# EAGLE design PCB (EAGLE 8.1.0)
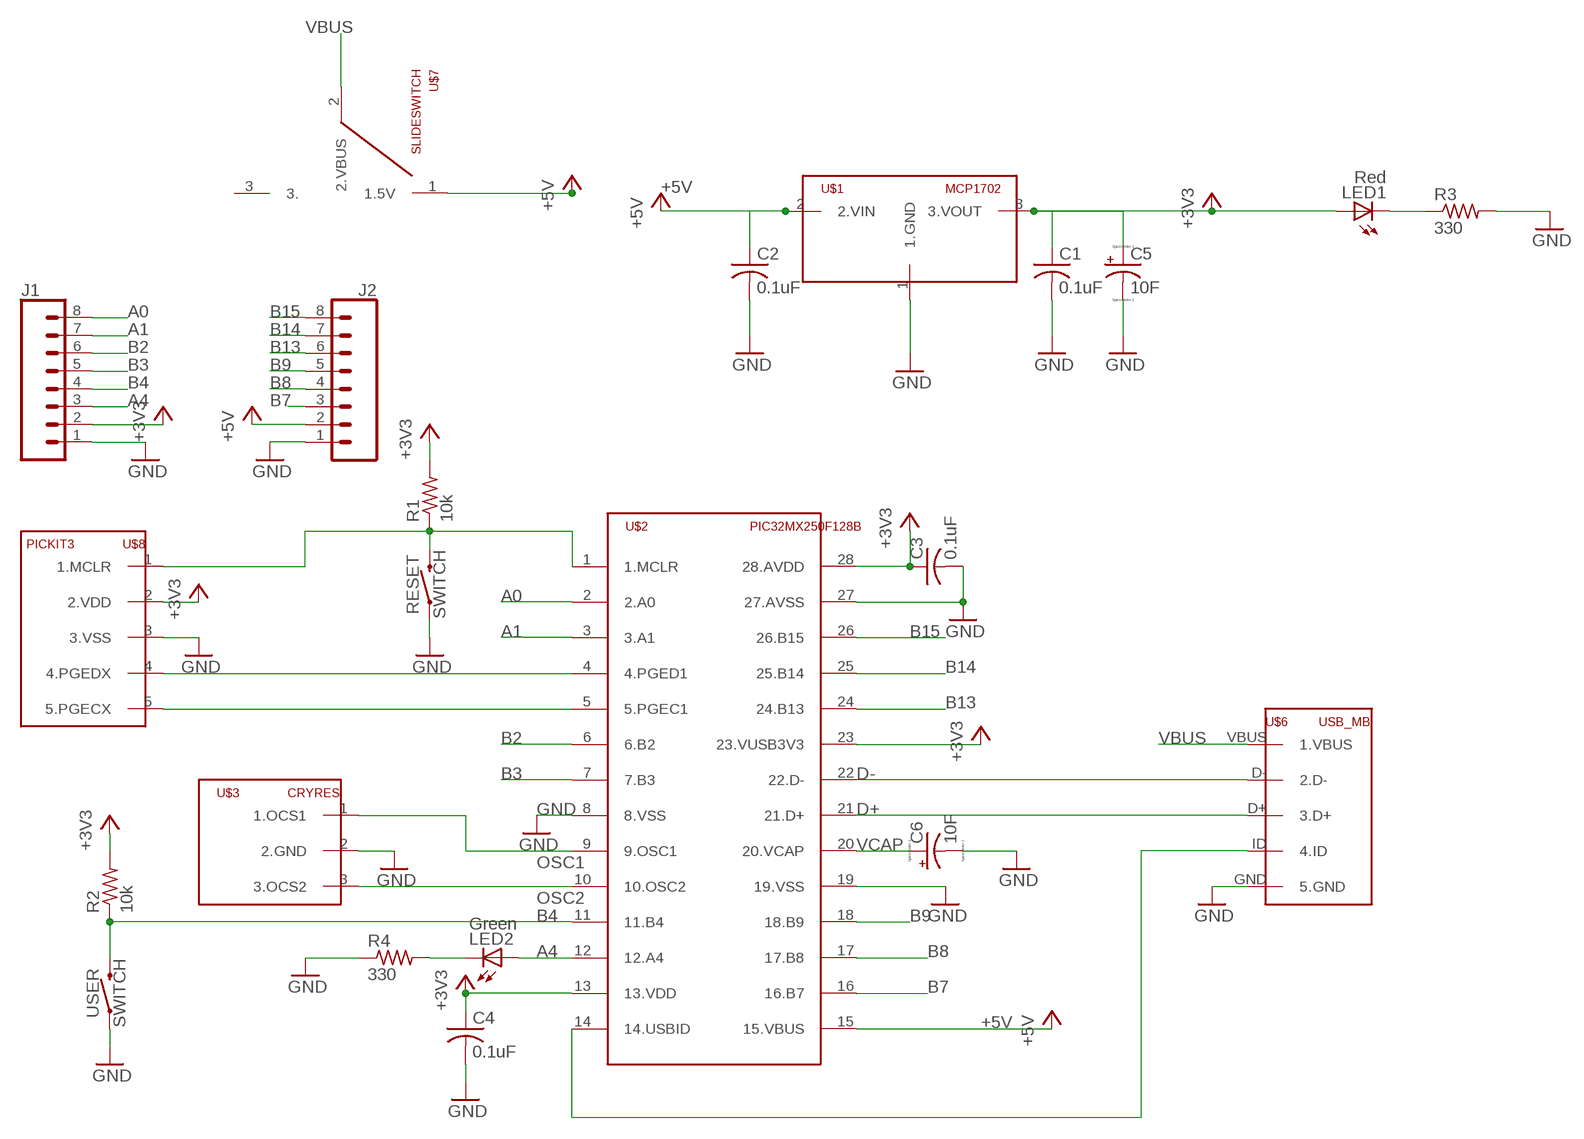
[diagram p0: schematic, sheet 1]

## Parts
C1  0.1uF  C-US025-025X050  [C025-025X050]
C2  0.1uF  C-US025-025X050  [C025-025X050]
C3  0.1uF  C-US025-025X050  [C025-025X050]
C4  0.1uF  C-US025-025X050  [C025-025X050]
C5  10F  CPOL-USE5-5  [E5-5]
C6  10F  CPOL-USE5-5  [E5-5]
J1  CONN_08"  [1X08]
J2  CONN_08"  [1X08]
LED1  Red  LED3MM  [LED3MM]
LED2  Green  LED3MM  [LED3MM]
R1  10k  R-US_0207/10  [0207/10]
R2  10k  R-US_0207/10  [0207/10]
R3  330  R-US_0207/10  [0207/10]
R4  330  R-US_0207/10  [0207/10]
RESET  SWITCH  [SWITCH]
U$1  MCP1702  [TO92]
U$2  PIC32MX250F128B  [DIL28-3]
U$3  CRYRES  [CRYSTAL]
U$6  USB_MB  [USB-MB-H]
U$7  SLIDESWITCH  [SLIDESWITCH]
U$8  PICKIT3  [1X05]
USER  SWITCH  [SWITCH]

## Nets
+3V3: C1.1 C3.1 C4.1 C5.+ J1.2 LED1.A R1.2 R2.2 U$1.3(3.VOUT) U$2.13(13.VDD) U$2.23(23.VUSB3V3) U$2.28(28.AVDD) U$8.2(2.VDD)
+5V: C2.1 J2.2 U$1.2(2.VIN) U$2.15(15.VBUS) U$7.1(1.5V)
A0: J1.8 U$2.2(2.A0)
A1: J1.7 U$2.3(3.A1)
A4: J1.3 LED2.A U$2.12(12.A4)
B2: J1.6 U$2.6(6.B2)
B3: J1.5 U$2.7(7.B3)
B4: J1.4 R2.1 U$2.11(11.B4) USER.2
B7: J2.3 U$2.16(16.B7)
B8: J2.4 U$2.17(17.B8)
B9: J2.5 U$2.18(18.B9)
B13: J2.6 U$2.24(24.B13)
B14: J2.7 U$2.25(25.B14)
B15: J2.8 U$2.26(26.B15)
D+: U$2.21(21.D+) U$6.D+(3.D+)
D-: U$2.22(22.D-) U$6.D-(2.D-)
GND: C1.2 C2.2 C3.2 C4.2 C5.- C6.- J1.1 J2.1 R3.2 R4.1 RESET.1 U$1.1(1.GND) U$2.8(8.VSS) U$2.19(19.VSS) U$2.27(27.AVSS) U$3.2(2.GND) U$6.GND(5.GND) U$8.3(3.VSS) USER.1
MCLR: R1.1 RESET.2 U$2.1(1.MCLR) U$8.1(1.MCLR)
N$1: LED1.K(C) R3.1
N$2: LED2.K(C) R4.2
OSC1: U$2.9(9.OSC1) U$3.1(1.OCS1)
OSC2: U$2.10(10.OSC2) U$3.3(3.OCS2)
PEGC1: U$2.5(5.PGEC1) U$8.5(5.PGECX)
PEGD1: U$2.4(4.PGED1) U$8.4(4.PGEDX)
USBID: U$2.14(14.USBID) U$6.ID(4.ID)
VBUS: U$6.VBUS(1.VBUS) U$7.2(2.VBUS)
VCAP: C6.+ U$2.20(20.VCAP)
Unconnected: U$7.3(3.)

## Library data of the parts
C1-C4 = ME433:C-US: CAPACITOR, American symbol
C5 C6 = ME433:CPOL-US: POLARIZED CAPACITOR, American symbol
J1 J2 = ME433:CONN_08: Multi connection point. Often used as Generic Header-pin footprint for 0.1 inch spaced/style header connections On any of the 0.1 inch spaced packages, you can populate with these: Break Away Headers - Straight <https://www.sparkfun.com/products/116> (PRT-00116) Break Away Male Headers - Right Angle <https://www.sparkfun.com/products/553> (PRT-00553) Female Headers <https://www.sparkfun.com/products/115> (PRT-00115) Break Away Headers - Machine Pin <https://www.sparkfun.com/products/117> (PRT-00117) Break Away Female Headers - Swiss Machine Pin <https://www.sparkfun.com/products/743> (PRT-00743) Arduino Stackable Header - 8 Pin <https://www.sparkfun.com/products/9279> (PRT-09279) For SCREWTERMINALS and SPRING TERMINALS visit here: Screw Terimnals on SparkFun.com <https://www.sparkfun.com/search/results?term=Screw+Terminals> (5mm/3.5mm/2.54mm spacing) This device is also useful as a general connection point to wire up your design to another part of your project. Our various solder wires solder well into these plated through hole pads. Hook-Up Wire - Assortment (Stranded, 22 AWG) <https://www.sparkfun.com/products/11375> (PRT-11375) Hook-Up Wire - Assortment (Solid Core, 22 AWG) <https://www.sparkfun.com/products/11367> (PRT-11367) View the entire wire category on our website here <https://www.sparkfun.com/categories/141> Special notes: Molex polarized connector foot print use with SKU : PRT-08231 with associated crimp pins and housings. 1MM SMD Version SKU: PRT-10208 NOTES ON THE VARIANTS LOCK and LOCK_LONGPADS... This footprint was designed to help hold the alignment of a through-hole component (i.e. 6-pin header) while soldering it into place. You may notice that each hole has been shifted either up or down by 0.005 of an inch from it's more standard position (which is a perfectly straight line). This slight alteration caused the pins (the squares in the middle) to touch the edges of the holes. Because they are alternating, it causes a "brace" to hold the component in place. 0.005 has proven to be the perfect amount of "off-center" position when using our standard breakaway headers. Although looks a little odd when you look at the bare footprint, once you have a header in there, the alteration is very hard to notice. Also,if you push a header all the way into place, it is covered up entirely on the bottom side.; PROD_ID: CONN-08438
LED1 LED2 = led:LED: LED OSRAM: - CHIPLED LG R971, LG N971, LY N971, LG Q971, LY Q971, LO R971, LY R971 LH N974, LH R974 LS Q976, LO Q976, LY Q976 LO Q996 - Hyper CHIPLED LW Q18S LB Q993, LB Q99A, LB R99A - SideLED LS A670, LO A670, LY A670, LG A670, LP A670 LB A673, LV A673, LT A673, LW A673 LH A674 LY A675 LS A676, LA A676, LO A676, LY A676, LW A676 LS A679, LY A679, LG A679 - Hyper Micro SIDELED® LS Y876, LA Y876, LO Y876, LY Y876 LT Y87S - SmartLED LW L88C, LW L88S LB L89C, LB L89S, LG L890 LS L89K, LO L89K, LY L89K LS L896, LA L896, LO L896, LY L896 - TOPLED LS T670, LO T670, LY T670, LG T670, LP T670 LSG T670, LSP T670, LSY T670, LOP T670, LYG T670 LG T671, LOG T671, LSG T671 LB T673, LV T673, LT T673, LW T673 LH T674 LS T676, LA T676, LO T676, LY T676, LB T676, LH T676, LSB T676, LW T676 LB T67C, LV T67C, LT T67C, LS T67K, LO T67K, LY T67K, LW E67C LS E67B, LA E67B, LO E67B, LY E67B, LB E67C, LV E67C, LT E67C LW T67C LS T679, LY T679, LG T679 LS T770, LO T770, LY T770, LG T770, LP T770 LB T773, LV T773, LT T773, LW T773 LH T774 LS E675, LA E675, LY E675, LS T675 LS T776, LA T776, LO T776, LY T776, LB T776 LHGB T686 LT T68C, LB T68C - Hyper Mini TOPLED® LB M676 - Mini TOPLED Santana® LG M470 LS M47K, LO M47K, LY M47K Source: http://www.osram.convergy.de LUXEON: - LUMILED® LXK2-PW12-R00, LXK2-PW12-S00, LXK2-PW14-U00, LXK2-PW14-V00 LXK2-PM12-R00, LXK2-PM12-S00, LXK2-PM14-U00 LXK2-PE12-Q00, LXK2-PE12-R00, LXK2-PE12-S00, LXK2-PE14-T00, LXK2-PE14-U00 LXK2-PB12-K00, LXK2-PB12-L00, LXK2-PB12-M00, LXK2-PB14-N00, LXK2-PB14-P00, LXK2-PB14-Q00 LXK2-PR12-L00, LXK2-PR12-M00, LXK2-PR14-Q00, LXK2-PR14-R00 LXK2-PD12-Q00, LXK2-PD12-R00, LXK2-PD12-S00 LXK2-PH12-R00, LXK2-PH12-S00 LXK2-PL12-P00, LXK2-PL12-Q00, LXK2-PL12-R00 Source: www.luxeon.com KINGBRIGHT: KA-3528ASYC Source: www.kingbright.com
R1-R4 = resistor:R-US_: RESISTOR, American symbol
RESET USER = ME433:SWITCH
U$1 = ME433:MCP1702
U$2 = ME433:PIC32MX250F128B
U$3 = ME433:CRYRES
U$6 = ME433:USB_MB
U$7 = ME433:SLIDESWITCH
U$8 = ME433:PICKIT3

## Board
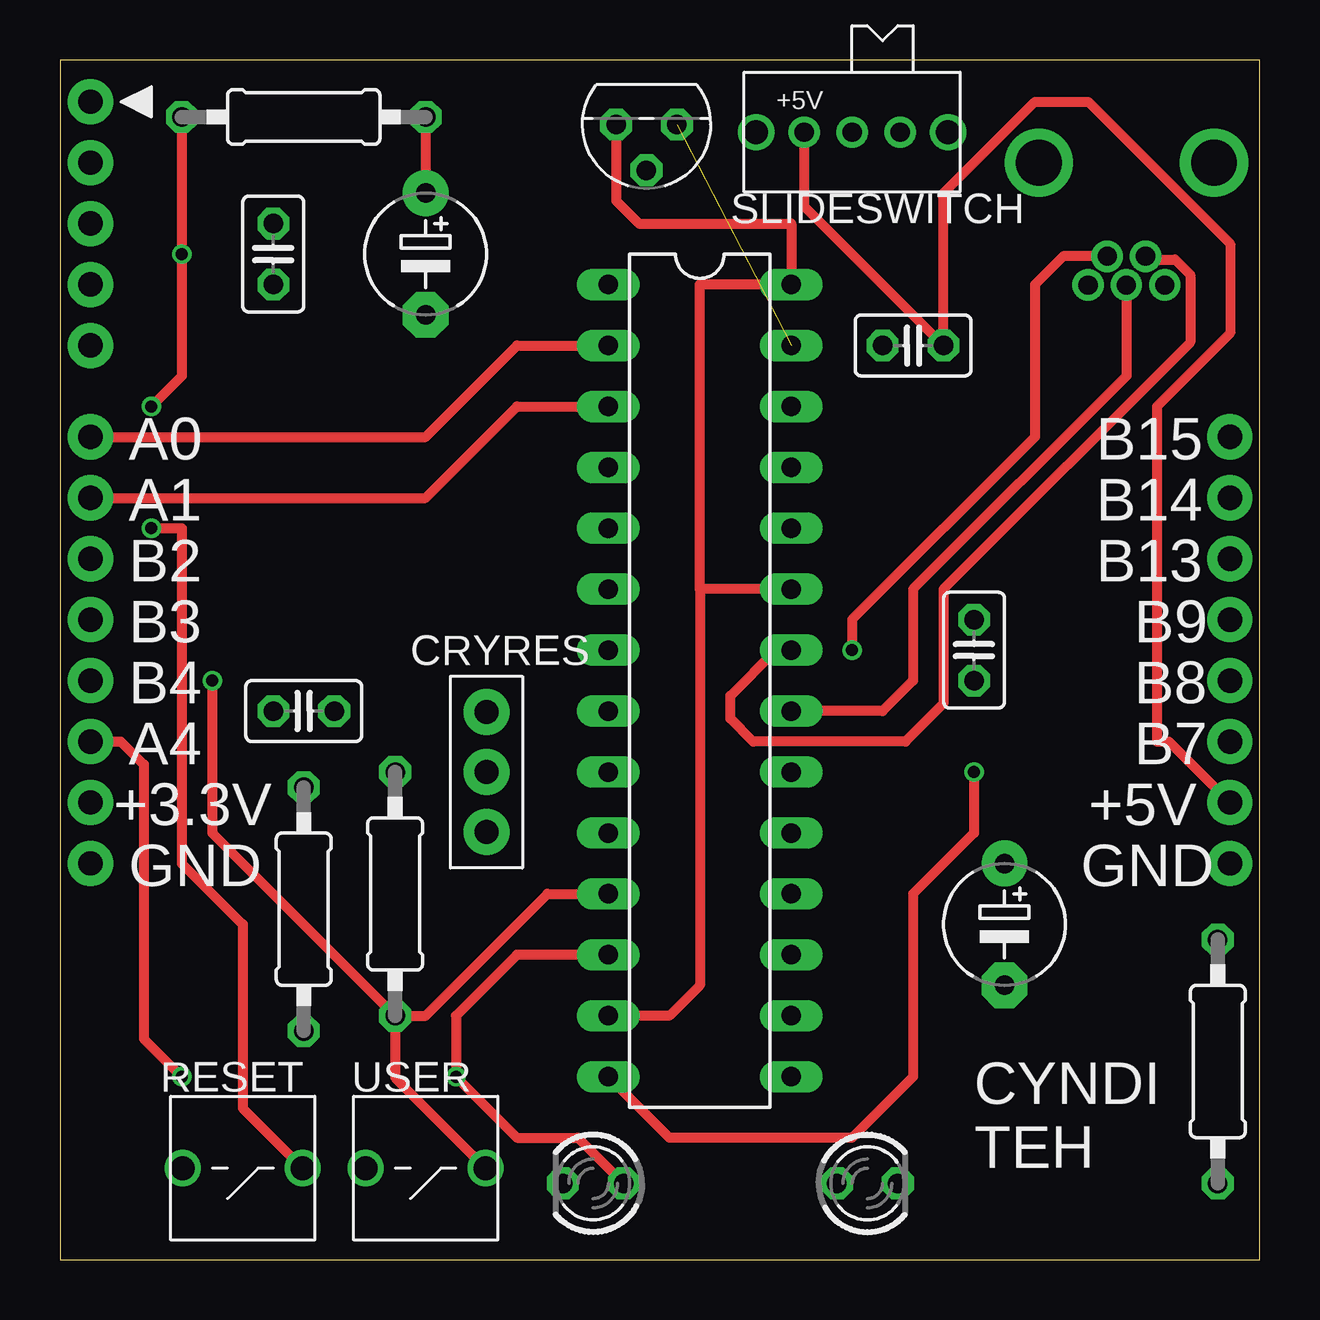
[diagram p1: board, top side]
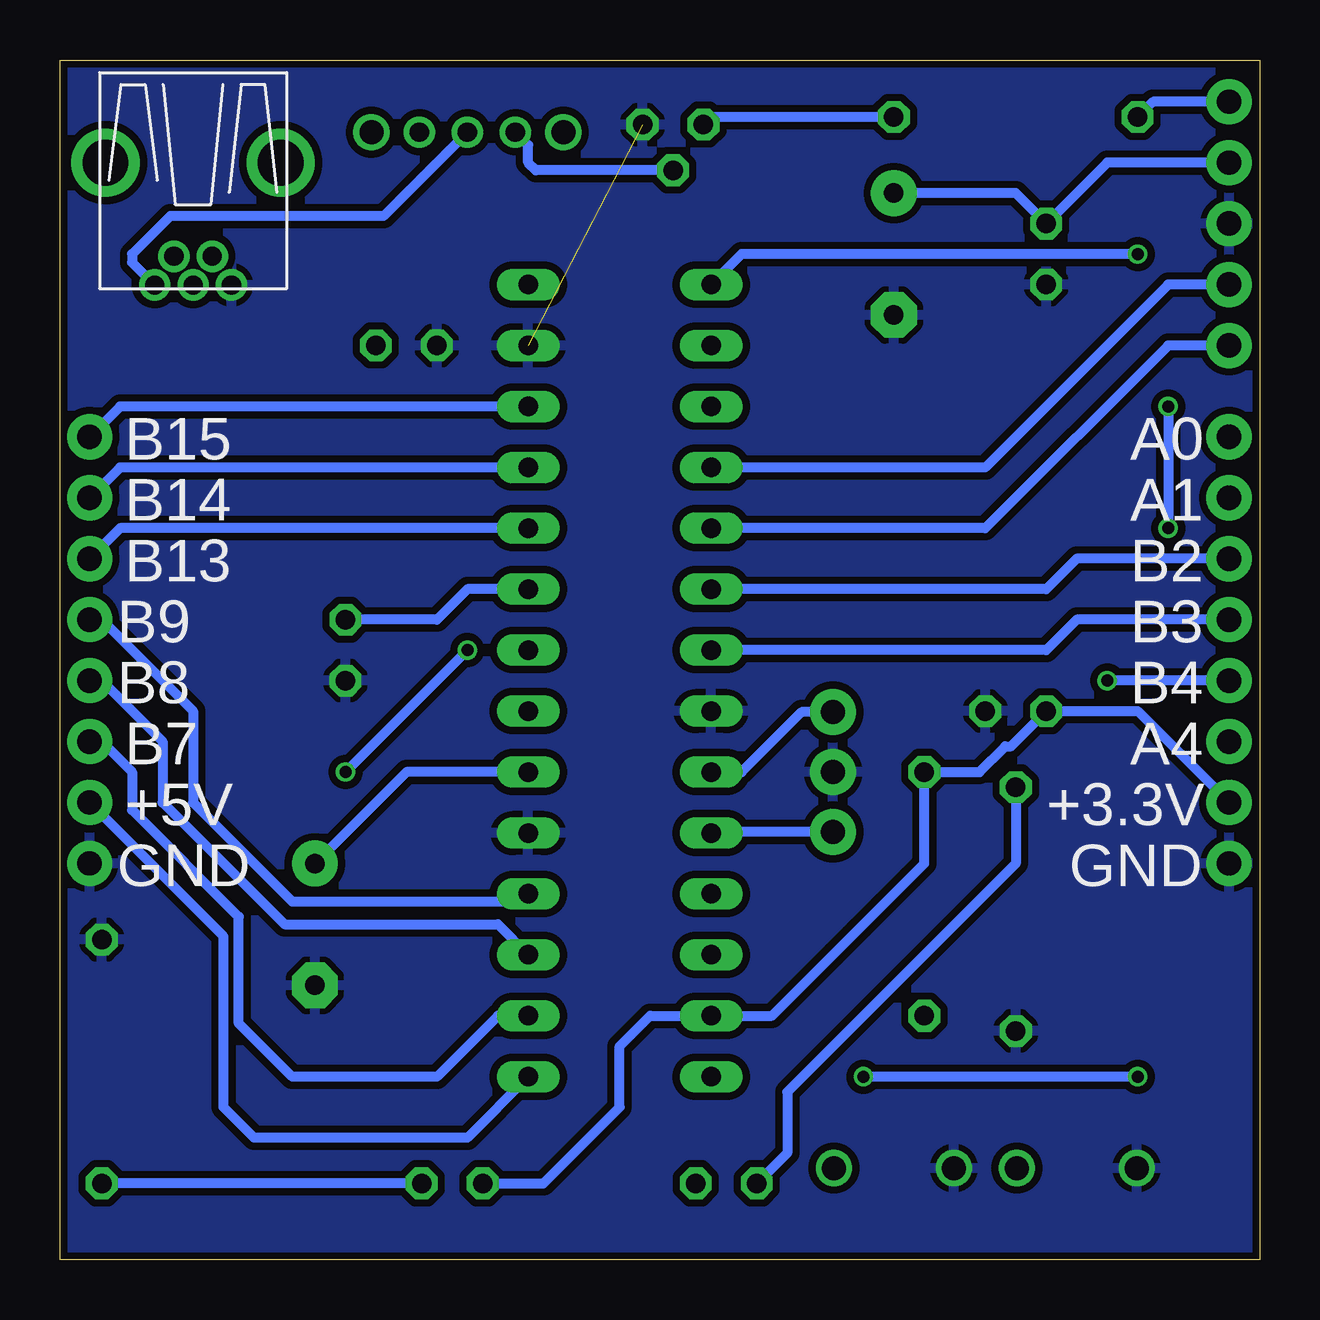
[diagram p2: board, bottom side, seen from below]

Size 50 x 50 mm. Coordinates in mm from the lower left corner, seen from the top.
Outline: 0,0 50,0 50,50 0,50 0,0
Copper layers (1*16): Top 0.035mm / dielectric 1.5mm / Bottom 0.035mm
Design rules "SeeedStudio_2layer_DRU_no_angle_20140221": minimum track width 6mil, minimum drill 12mil, track to track 6mil, track to pad 6mil, pad to pad 6mil, via to via 6mil, smd to smd 0mil, copper to edge 10mil, drill to drill 10mil, minimum pad ring 10mil, minimum via ring 6mil, stop-mask expansion 2mil, vias tented up to drill 100mil, thermal gap 10mil

### Footprints (pad centres in the part's own frame; a part is rotated, then mirrored left to right if it is on the bottom)
C025-025X050 = drill 0.813 octagon: 1 -1.27,0; 2 1.27,0
E5-5 = drill 0.813 pad 1.905: + -2.54,0 | drill 0.813 pad 1.905 octagon: - 2.54,0
1X08 = drill 1.016 pad 1.88: 1 0,0; 2 2.54,0; 3 5.08,0; 4 7.62,0; 5 10.16,0; 6 12.7,0; 7 15.24,0; 8 17.78,0
LED3MM = drill 0.813 octagon: A -1.27,0; K 1.27,0
0207/10 = drill 0.813 octagon: 1 -5.08,0; 2 5.08,0
SWITCH = drill 1: 1 2.5,0; 2 -2.5,0
TO92 = drill 0.813 octagon: 1 -1.27,0; 2 0,1.905; 3 1.27,0
DIL28-3 = drill 0.813 long: 1 -16.51,-3.81; 2 -13.97,-3.81; 3 -11.43,-3.81; 4 -8.89,-3.81; 5 -6.35,-3.81; 6 -3.81,-3.81; 7 -1.27,-3.81; 8 1.27,-3.81; 9 3.81,-3.81; 10 6.35,-3.81; 11 8.89,-3.81; 12 11.43,-3.81; 13 13.97,-3.81; 14 16.51,-3.81; 15 16.51,3.81; 16 13.97,3.81; 17 11.43,3.81; 18 8.89,3.81; 19 6.35,3.81; 20 3.81,3.81; 21 1.27,3.81; 22 -1.27,3.81; 23 -3.81,3.81; 24 -6.35,3.81; 25 -8.89,3.81; 26 -11.43,3.81; 27 -13.97,3.81; 28 -16.51,3.81
CRYSTAL = drill 1 pad 1.93: 1 -2.5,0; 2 0,0; 3 2.5,0
USB-MB-H = drill 0.8: D+ 5.1,0; D- 3.9,0.8; GND 5.1,-1.6; ID 3.9,-0.8; VBUS 5.1,1.6 | drill 1.9: P$6 0,-3.65; P$7 0,3.65
SLIDESWITCH = drill 0.8: 1 -2,0; 2 0,0; 3 2,0 | drill 1: S1 -4,0; S2 4,0
1X05 = drill 1.016 pad 1.88: 1 0,0; 2 2.54,0; 3 5.08,0; 4 7.62,0; 5 10.16,0

### Placement (x,y rotation side)
C1  8.89,41.91 270 top
C2  35.56,38.1 180 top
C3  38.1,25.4 270 top
C4  10.16,22.86 0 top
C5  15.24,41.91 270 top
C6  39.37,13.97 270 top
J1  1.27,16.51 90 top
J2  48.77,16.51 90 top
LED1  33.66,3.17 0 top
LED2  22.23,3.17 180 top
R1  10.16,47.62 0 top
R2  13.97,15.24 90 top
R3  48.26,8.26 90 top
R4  10.16,14.61 90 top
RESET  7.62,3.81 180 top
U$1  24.45,47.31 180 top
U$2  26.67,24.13 270 top
U$3  17.78,20.32 270 top
U$6  44.45,45.72 270 top
U$7  33.02,46.99 0 top
U$8  1.27,48.26 270 top
USER  15.24,3.81 180 top

### Tracks (layer width: path | path; a pad name or v marks a point on that pad's centre or on a via)
+3V3
  Top 0.406: U$1.3 23.18,44.13 24.13,43.18 30.48,43.18 U$2.28 26.67,40.64 26.67,27.94 | U$2.13 25.4,10.16 26.67,11.43 26.67,27.94 | U$2.23 26.67,27.94 | R1.2 C5.+
  Bottom 0.406: R1.2 22.86,47.62 U$1.3 | U$2.23 33.02,27.94 34.29,26.67 C3.1 | J1.2 5.08,22.86 C4.1 10.36,21.39 10.6,21.39 11.67,20.32 R2.2 13.97,16.51 20.32,10.16 U$2.13 25.4,10.16 26.67,8.89 26.67,6.35 29.84,3.17 LED1.A | U$8.2 6.35,45.72 C1.1 10.16,44.45 C5.+
+5V
  Top 0.406: U$7.1 31.02,43.91 C2.1 36.83,44.45 40.64,48.26 42.86,48.26 48.78,42.34 48.78,38.62 45.72,35.56 45.72,21.59 46.23,21.59 J2.2
  Bottom 0.406: U$2.15 33.02,5.08 41.91,5.08 43.18,6.35 43.18,13.46 J2.2 | U$1.2 30.16,45.4 30.48,45.72 30.48,46.45 U$7.1
A0
  Top 0.406: J1.8 15.24,34.29 19.05,38.1 U$2.2
A1
  Top 0.406: J1.7 15.24,31.75 19.05,35.56 U$2.3
A4  (via drill 0.5)
  Top 0.406: U$2.12 19.05,12.7 16.51,10.16 v16.51,7.62 19.05,5.08 21.59,5.08 LED2.A | J1.3 2.54,21.59 3.49,20.64 3.49,9.21 v5.08,7.62
  Bottom 0.406: v5.08,7.62 v16.51,7.62
B2
  Bottom 0.406: J1.6 7.62,29.21 8.89,27.94 U$2.6
B3
  Bottom 0.406: J1.5 7.62,26.67 8.89,25.4 U$2.7
B4  (via drill 0.5)
  Top 0.406: v6.35,24.13 6.35,17.78 R2.1 | R2.1 15.24,10.16 20.32,15.24 U$2.11 | R2.1 13.97,7.58 USER.2
  Bottom 0.406: J1.4 v6.35,24.13
B7
  Bottom 0.406: U$2.16 31.75,10.16 34.29,7.62 40.32,7.62 42.55,9.84 42.55,14.29 46.99,18.73 46.99,20.32 48.26,21.59 J2.3
B8
  Bottom 0.406: J2.4 48.26,24.13 45.72,21.59 45.72,19.05 40.64,13.97 31.75,13.97 U$2.17
B9
  Bottom 0.406: J2.5 48.26,26.67 44.45,22.86 44.45,19.05 40.32,14.92 30.8,14.92 U$2.18
B13
  Bottom 0.406: U$2.24 47.5,30.48 J2.6
B14
  Bottom 0.406: J2.7 47.5,33.02 U$2.25
B15
  Bottom 0.406: J2.8 47.5,35.56 U$2.26
D+
  Top 0.406: U$6.D+ 44.45,36.83 35.56,27.94 35.56,24.13 34.29,22.86 U$2.21
D-
  Top 0.406: U$6.D- 45.39,41.68 46.49,41.68 47.11,41.06 47.11,38.22 36.83,27.94 36.83,23.18 35.24,21.59 28.89,21.59 27.94,22.54 27.94,23.5 29.84,25.4 U$2.22
GND  (1 unrouted)
  pour Bottom (isolate 0.305): 0,50.16 50.16,50.16 50.16,0 0,0
MCLR  (via drill 0.5)
  Top 0.406: R1.1 v5.08,41.91 5.08,36.83 v3.81,35.56 | v3.81,30.48 5.08,30.48 5.08,16.51 7.62,13.97 7.62,6.31 RESET.2
  Bottom 0.406: U$8.1 4.45,48.26 R1.1 | U$2.1 21.59,41.91 v5.08,41.91 | v3.81,35.56 v3.81,30.48
N$1
  Bottom 0.406: LED1.K R3.1
N$2
  Bottom 0.406: R4.2 10.16,16.51 19.68,6.99 19.68,4.45 LED2.K
OSC1
  Bottom 0.406: U$3.1 19.09,22.82 21.59,20.32 U$2.9
OSC2
  Bottom 0.406: U$3.3 22.82,17.82 U$2.10
PEGC1
  Bottom 0.406: U$8.5 3.81,38.1 11.43,30.48 U$2.5
PEGD1
  Bottom 0.406: U$8.4 3.81,40.64 11.43,33.02 U$2.4
USBID  (via drill 0.5)
  Top 0.406: U$6.ID 41.82,41.82 40.64,40.64 40.64,34.29 33.02,26.67 v33.02,25.4 | v38.1,20.32 38.1,17.78 35.56,15.24 35.56,7.62 33.02,5.08 25.4,5.08 U$2.14
  Bottom 0.406: v33.02,25.4 v38.1,20.32
VBUS
  Bottom 0.406: U$7.2 36.51,43.5 45.4,43.5 46.99,41.91 46.99,41.56 U$6.VBUS
VCAP
  Bottom 0.406: U$2.20 35.56,20.32 C6.+

### Text on the board
tNames: +5V | A0 | B15 | A1 | B14 | B2 | B13 | B3 | B9 | B4 | B8 | A4 | B7 | +3.3V | +5V | GND | GND | CYNDI / TEH
bNames: A0 | B15 | A1 | B14 | B2 | B13 | B3 | B9 | B4 | B8 | A4 | B7 | +3.3V | +5V | GND | GND